# EAGLE design minishield-springswitch (EAGLE 7.6.0)
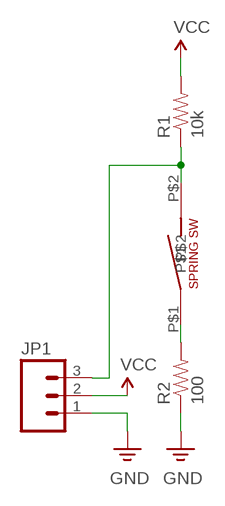
[diagram p0: schematic, sheet 1]

## Parts
JP1  M03PTH  [1X03]
R1  10k  RESISTOR0402-RES  [0402-RES]
R2  100  RESISTOR0402-RES  [0402-RES]
S1  SPRING_SWITCH  [SW-18020P-RA]

## Nets
GND: JP1.1 R2.1
N$1: JP1.3 R1.1 S1.P$2
N$2: R2.2 S1.P$1
VCC: JP1.2 R1.2

## Library data of the parts
JP1 = SparkFun-Connectors:M03: Header 3 Standard 3-pin 0.1" header. Use with straight break away headers (SKU : PRT-00116), right angle break away headers (PRT-00553), swiss pins (PRT-00743), machine pins (PRT-00117), and female headers (PRT-00115). Molex polarized connector foot print use with SKU : PRT-08232 with associated crimp pins and housings.
R1 R2 = SparkFun-Resistors:RESISTOR: Resistor Basic schematic elements and footprints for 0603, 1206, and PTH resistors.
S1 = spring_switch:SPRING_SWITCH

## Board
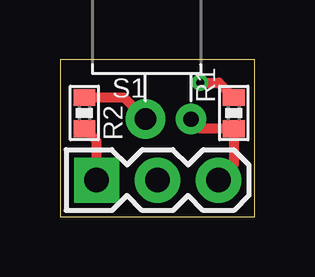
[diagram p1: board, top side]
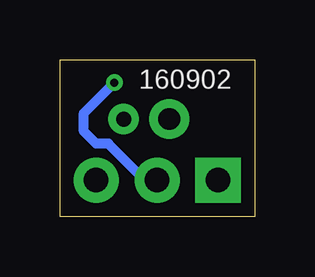
[diagram p2: board, bottom side, seen from below]

Size 8.11 x 6.53 mm. Coordinates in mm from the lower left corner, seen from the top.
Outline: 0,0 8.11,0 8.11,6.53 0,6.53 0,0
Copper layers (1*16): Top 0.0356mm / dielectric 1.5011mm / Bottom 0.0356mm
Design rules "LaenPCBOrder *": minimum track width 6mil, minimum drill 13mil, track to track 6mil, track to pad 6mil, pad to pad 6mil, via to via 6mil, smd to smd 6mil, copper to edge 15mil, drill to drill 6mil, minimum pad ring 7mil, minimum via ring 7mil, stop-mask expansion 3mil, vias tented up to drill 14mil, thermal gap 10mil

### Footprints (pad centres in the part's own frame; a part is rotated, then mirrored left to right if it is on the bottom)
1X03 = drill 1.016 pad 1.88 square: 1 0,0 | drill 1.016 pad 1.88: 2 2.54,0; 3 5.08,0
0402-RES = smd 0.7 x 0.9: 1 -0.65,0; 2 0.65,0
SW-18020P-RA = drill 0.9 pad 1.651: P$1 0,0 | drill 0.635 pad 1.27: P$2 0,-1.9

### Placement (x,y rotation side)
JP1  1.52,1.52 0 top
R1  7.24,4.32 90 top
R2  1.02,4.32 90 top
S1  3.56,4.06 90 top

### Tracks (layer width: path | path; a pad name or v marks a point on that pad's centre or on a via)
GND
  Top 0.406: JP1.1 1.52,3.16 R2.1
N$1
  Top 0.406: S1.P$2 5.85,3.67 R1.1 7.24,2.16 JP1.3
N$2
  Top 0.406: R2.2 2.65,4.97 S1.P$1
VCC  (via drill 0.33)
  Top 0.406: v5.84,5.59 6.62,5.59 R1.2
  Bottom 0.406: JP1.2 4.57,1.52 6.1,3.05 6.6,3.05 7.11,3.56 7.11,4.32 v5.84,5.59

### Text on the board
bPlace: 160902